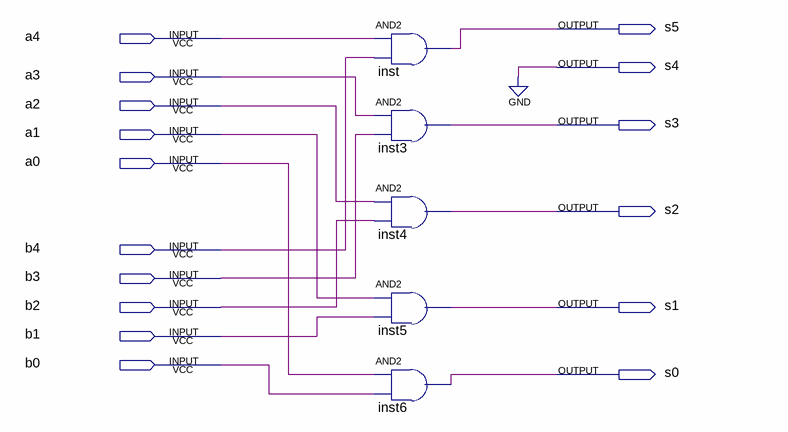
[diagram p0: schematic sheet]
// Quartus schematic aandb.bdf as structural Verilog: 5 symbols, 16 pins
module aandb (
  input  a4,
  input  a3,
  input  a2,
  input  a1,
  input  a0,
  input  b4,
  input  b3,
  input  b2,
  input  b1,
  input  b0,
  output s5,
  output s4,
  output s3,
  output s2,
  output s1,
  output s0
);

  and inst (s5, a4, b4);
  and inst3 (s3, a3, b3);
  and inst4 (s2, a2, b2);
  and inst5 (s1, a1, b1);
  and inst6 (s0, a0, b0);

  assign s4 = 1'b0;
endmodule
